# Altium schematic sheet Ultrasonic_Transmitter.SchDoc: Ultrasonic Transmitter
size A4; Author: Álvaro Hernando; CompanyName: bq - Mundo Reader; Organization: bq - Mundo Reader; DocumentNumber: 1; Revision: 1.0; SheetNumber: 2; SheetTotal: 3
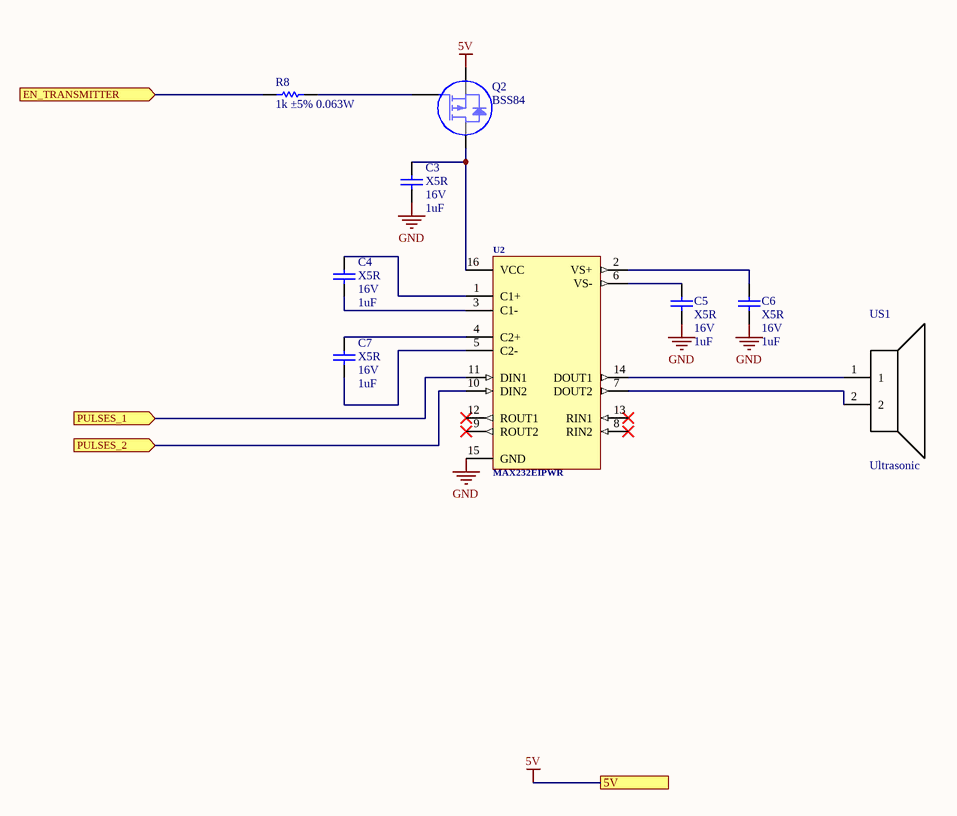
[diagram p0: Ultrasonic_Transmitter.SchDoc]

## Parts
C3  Dielectric: X5R  Voltage: 16V  Capacitance: 1uF  [C0603]  (hidden comment: Capacitor)
C4  Dielectric: X5R  Voltage: 16V  Capacitance: 1uF  [C0603]  (hidden comment: Capacitor)
C5  Dielectric: X5R  Voltage: 16V  Capacitance: 1uF  [C0603]  (hidden comment: Capacitor)
C6  Dielectric: X5R  Voltage: 16V  Capacitance: 1uF  [C0603]  (hidden comment: Capacitor)
C7  Dielectric: X5R  Voltage: 16V  Capacitance: 1uF  [C0603]  (hidden comment: Capacitor)
Q2  BSS84  [SOT23-3]
R8  value 1k ±5% 0.063W  [R0402]  (hidden comment: Resistor)
U2  MAX232EIPWR  [TSSOP16]
US1  Ultrasonic  [NU40C16]

## Ports
5V, EN_TRANSMITTER (in), PULSES_1 (in), PULSES_2 (in)

## Nets
5V: Q2.2(S) ; port 5V
GND: C3.1 C5.1 C6.1 U2.15(GND)
EN_TRANSMITTER: R8.1 ; port EN_TRANSMITTER
PULSES_1: U2.11(DIN1) ; port PULSES_1
PULSES_2: U2.10(DIN2) ; port PULSES_2
NetC3_2: C3.2 Q2.3(D) U2.16(VCC)
NetC4_1: C4.1 U2.3(C1-)
NetC4_2: C4.2 U2.1(C1+)
NetC5_2: C5.2 U2.6(VS-)
NetC6_2: C6.2 U2.2(VS+)
NetC7_1: C7.1 U2.5(C2-)
NetC7_2: C7.2 U2.4(C2+)
NetQ2_1: Q2.1(G) R8.2
NetU2_7: U2.7(DOUT2) US1.2
NetU2_14: U2.14(DOUT1) US1.1

Not connected (* = marked no-connect by the designer): U2 8(RIN2)* 9(ROUT2)* 12(ROUT1)* 13(RIN1)*

## Notes on the sheet
- Title
- Project
- Size:
- Author
- A4
- Number:
- Revision:
- Mundo Reader, S.L. This project and all the sheets and layouts enclosed are licensed under Creative Commons by Attribution and Share Alike [CC BY-SA] (www.creativecommons.com)
- Date:
- Time:
- Sheet
- of

## Library data of the parts
C3-C7 = C0603_1uF_16V_±10%: Capacitor SMD; Manufacturer: Kemet; Value: 1uF ±10% 16V; Tolerance: ±10%; OrderingCode: C0603C105K4PAC; Temp_ Max: 125; Temp_ Min: -55; Part Number: C0603_1uF_16V_±10%
Q2 = BSS84: PFET; Manufacturer: Fairchild Semiconductor; Vds: 50V; Vgss: 20V; Id: 0,13A; Temp_ Max: 150; Temp_ Min: -55; Part Number: BSS84; OrderingCode: BSS84
R8 = R0402_1k_0.063W_±5%: Resistor, SMD; Manufacturer: Vishay; Tolerance: ±5%; OrderingCode: CRCW04021K00JN; Power: 0.063W; Resistance: 1k; Temp_ Max: 155; Temp_ Min: -55; PackageDescription: SMD; Part Number: R0402_1k_0.063W_±5%
U2 = MAX232EIPWR: Dual RS-232 Driver/Receiver; Manufacturer: Texas Instruments; Temp_ Max: 85; Temp_ Min: -40; OrderingCode 2: MAX232ECPWR; Part Number: MAX232EIPWR; OrderingCode: MAX232EIPWR; Manufacturer 2: Texas Instruments
US1 = NU40C16T-2: Ultrasonic Sensor; Manufacturer: Jinci; Temp_ Max: 70; Temp_ Min: -20; Part Number: NU40C16T-2; OrderingCode: NU40C16T-2